# EAGLE design Main board (EAGLE 6.3)
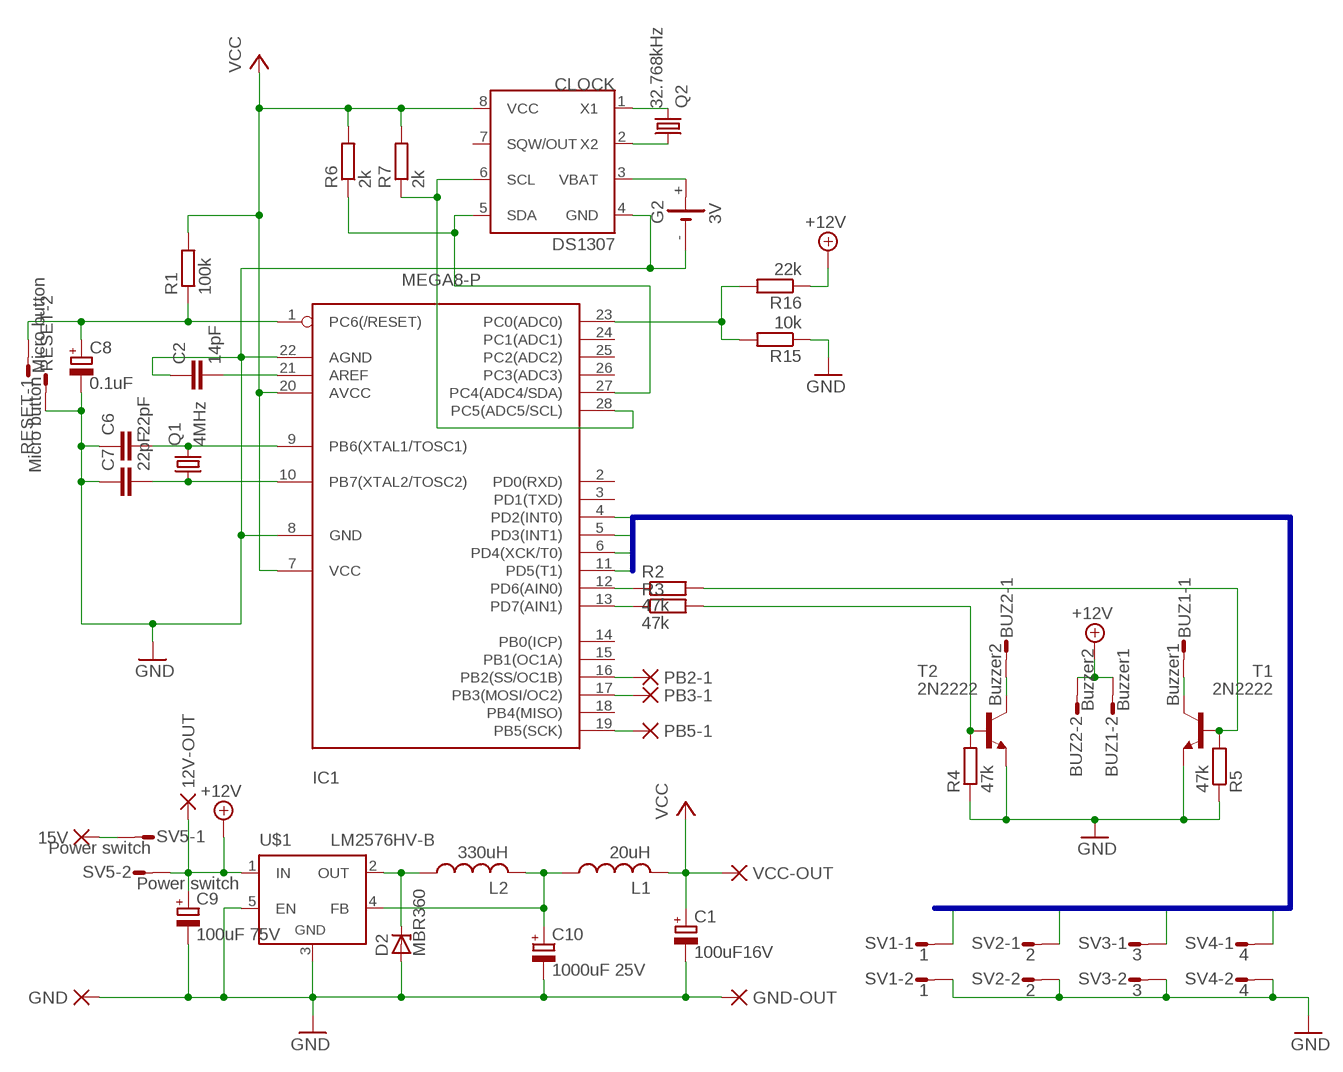
[diagram p0: schematic, sheet 1]

## Parts
12V-OUT  PAD-0500  [0500]
15V  PAD-0500  [0500]
BUZ1  Buzzer1  S02P  [S02P]
BUZ2  Buzzer2  S02P  [S02P]
C1  100uF16V  CPOL-EUE2.5-6  [E2,5-6]
C2  14pF  C-EU025-050X050  [C025-050X050]
C6  22pF  C-EU025-030X050  [C025-030X050]
C7  22pF  C-EU025-030X050  [C025-030X050]
C8  0.1uF  CPOL-EUE2.5-6  [E2,5-6]
C9  100uF 75V  CPOL-EUE5-10.5  [E5-10,5]
C10  1000uF 25V  CPOL-EUE5-10.5  [E5-10,5]
CLOCK  DS1307  [SOIC-8]
D2  MBR360  ZENER-DIODEC1702-15  [C1702-15]
G2  3V  SL-340/P  [BEL/P]
GND  PAD-0500  [0500]
GND-OUT  PAD-0500  [0500]
IC1  MEGA8-P  [DIL28-3]
L1  20uH  L-USTJ3-U1  [TJ3-U1]
L2  330uH  L-USTJ3-U1  [TJ3-U1]
PB2-1  PAD-0400  [0400]
PB3-1  PAD-0400  [0400]
PB5-1  PAD-0400  [0400]
Q1  4MHz  CRYSTALHC49U-V  [HC49U-V]
Q2  32.768kHz  CRYSTAL  [CRYSTAL]
R1  100k  R-EU_0309/15  [0309/15]
R2  47k  R-EU_0309/15  [0309/15]
R3  47k  R-EU_0309/15  [0309/15]
R4  47k  R-EU_0309/15  [0309/15]
R5  47k  R-EU_0309/15  [0309/15]
R6  2k  R-EU_0309/15  [0309/15]
R7  2k  R-EU_0309/15  [0309/15]
R15  10k  R-EU_0309/15  [0309/15]
R16  22k  R-EU_0309/15  [0309/15]
RESET  Micro button  S02P  [S02P]
SV1  1  S02P  [S02P]
SV2  2  S02P  [S02P]
SV3  3  S02P  [S02P]
SV4  4  S02P  [S02P]
SV5  Power switch  S02P  [S02P]
T1  2N2222  [TO18]
T2  2N2222  [TO18]
U$1  LM2576HV-B  [TO220-53]
VCC-OUT  PAD-0500  [0500]

## Nets
+12V: 12V-OUT.P$1(P) BUZ1.2 BUZ2.2 C9.+ R16.1 SV5.2 U$1.1(IN)
GND: C1.- C2.1 C6.1 C7.1 C8.- C9.- C10.- CLOCK.4(GND) D2.A G2.- GND-OUT.P$1(P) GND.P$1(P) IC1.8(GND) IC1.22(AGND) R4.1 R5.1 R15.1 RESET.2 SV1.2 SV2.2 SV3.2 SV4.2 T1.1(E) T2.1(E) U$1.3(GND) U$1.5(EN)
INPUT1: IC1.4(PD2(INT0)) SV1.1
INPUT2: IC1.5(PD3(INT1)) SV2.1
INPUT3: IC1.6(PD4(XCK/T0)) SV3.1
INPUT4: IC1.11(PD5(T1)) SV4.1
N$1: CLOCK.1(X1) Q2.2
N$2: 15V.P$1(P) SV5.1
N$3: CLOCK.2(X2) Q2.1
N$14: C2.2 IC1.21(AREF)
N$15: C6.2 IC1.9(PB6(XTAL1/TOSC1)) Q1.2
N$16: C7.2 IC1.10(PB7(XTAL2/TOSC2)) Q1.1
N$18: C8.+ IC1.1(PC6(/RESET)) R1.1 RESET.1
N$19: CLOCK.6(SCL) IC1.28(PC5(ADC5/SCL)) R7.1
N$20: IC1.23(PC0(ADC0)) R15.2 R16.2
N$22: CLOCK.5(SDA) IC1.27(PC4(ADC4/SDA)) R6.1
N$33: IC1.12(PD6(AIN0)) R2.1
N$34: IC1.13(PD7(AIN1)) R3.1
N$36: BUZ2.1 T2.3(C)
N$37: R3.2 R4.2 T2.2(B)
N$39: R2.2 R5.2 T1.2(B)
N$40: BUZ1.1 T1.3(C)
N$60: IC1.16(PB2(SS/OC1B)) PB2-1.P$1(P)
N$63: C10.+ L1.1 L2.2 U$1.4(FB)
N$64: D2.C L2.1 U$1.2(OUT)
N$66: IC1.17(PB3(MOSI/OC2)) PB3-1.P$1(P)
N$67: IC1.19(PB5(SCK)) PB5-1.P$1(P)
VBAT: CLOCK.3(VBAT) G2.+
VCC: C1.+ CLOCK.8(VCC) IC1.7(VCC) IC1.20(AVCC) L1.2 R1.2 R6.2 R7.2 VCC-OUT.P$1(P)
Unconnected: CLOCK.7(SQW/OUT) IC1.2(PD0(RXD)) IC1.3(PD1(TXD)) IC1.14(PB0(ICP)) IC1.15(PB1(OC1A)) IC1.18(PB4(MISO)) IC1.24(PC1(ADC1)) IC1.25(PC2(ADC2)) IC1.26(PC3(ADC3))

## Buses
INPUT[1..4]

## Library data of the parts
12V-OUT 15V GND GND-OUT PB2-1 PB3-1 PB5-1 VCC-OUT = ~~dpads:PAD: WIRE PAD Standard US Drill Sizes and SMD pads
BUZ1 BUZ2 RESET SV1-SV5 = con-amp-mt:S02P: AMP MT CONNECTOR
C1 C9 C10 = ~~rcl:CPOL-EU: POLARIZED CAPACITOR, European symbol
C2 C6 C7 = ~~rcl:C-EU: CAPACITOR, European symbol
C8 = rcl:CPOL-EU: POLARIZED CAPACITOR, European symbol
CLOCK = ~~dallas:DS1307: I2C Serial RTC w/56 bytes battery backed RAM
D2 = diode:ZENER-DIODE: Z-Diode
G2 = battery:SL-340/P: LI BATTERY Sonnenschein SL-340
IC1 = atmel:MEGA8-P: MICROCONTROLLER 8 Kbytes FLASH, 1 kbytes SRAM, 512 bytes EEPROM, USART, 4-channel 10 bit ADC, 2-channel 8 bit ADC Pin compatible with Atmega48, ATMega88, ATMega168 Source: avr.lbr
L1 L2 = ~~rcl:L-US: INDUCTOR, American symbol
Q1 = crystal:CRYSTAL: CRYSTAL
Q2 = ~~mano:CRYSTAL
R1-R7 R15 R16 = ~~rcl:R-EU_: RESISTOR, European symbol
T1 T2 = transistor:2N2222: NPN TRANSISTOR
U$1 = ~~linear:LM2576HV-*

## Board
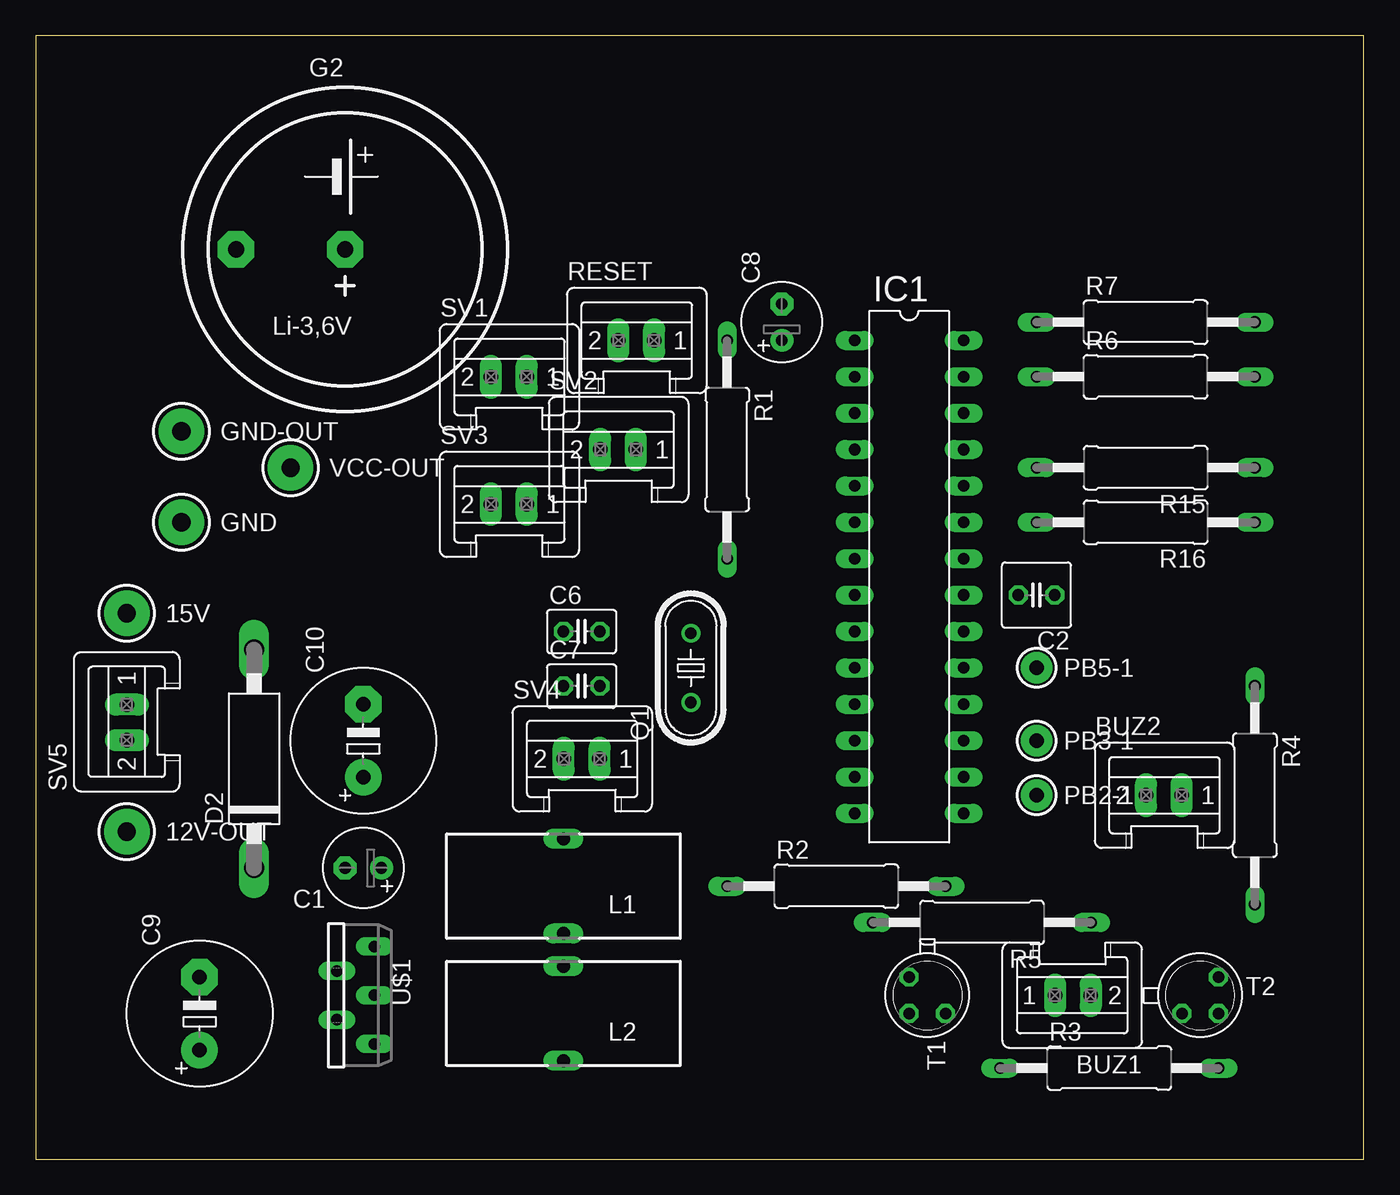
[diagram p1: board, top side]
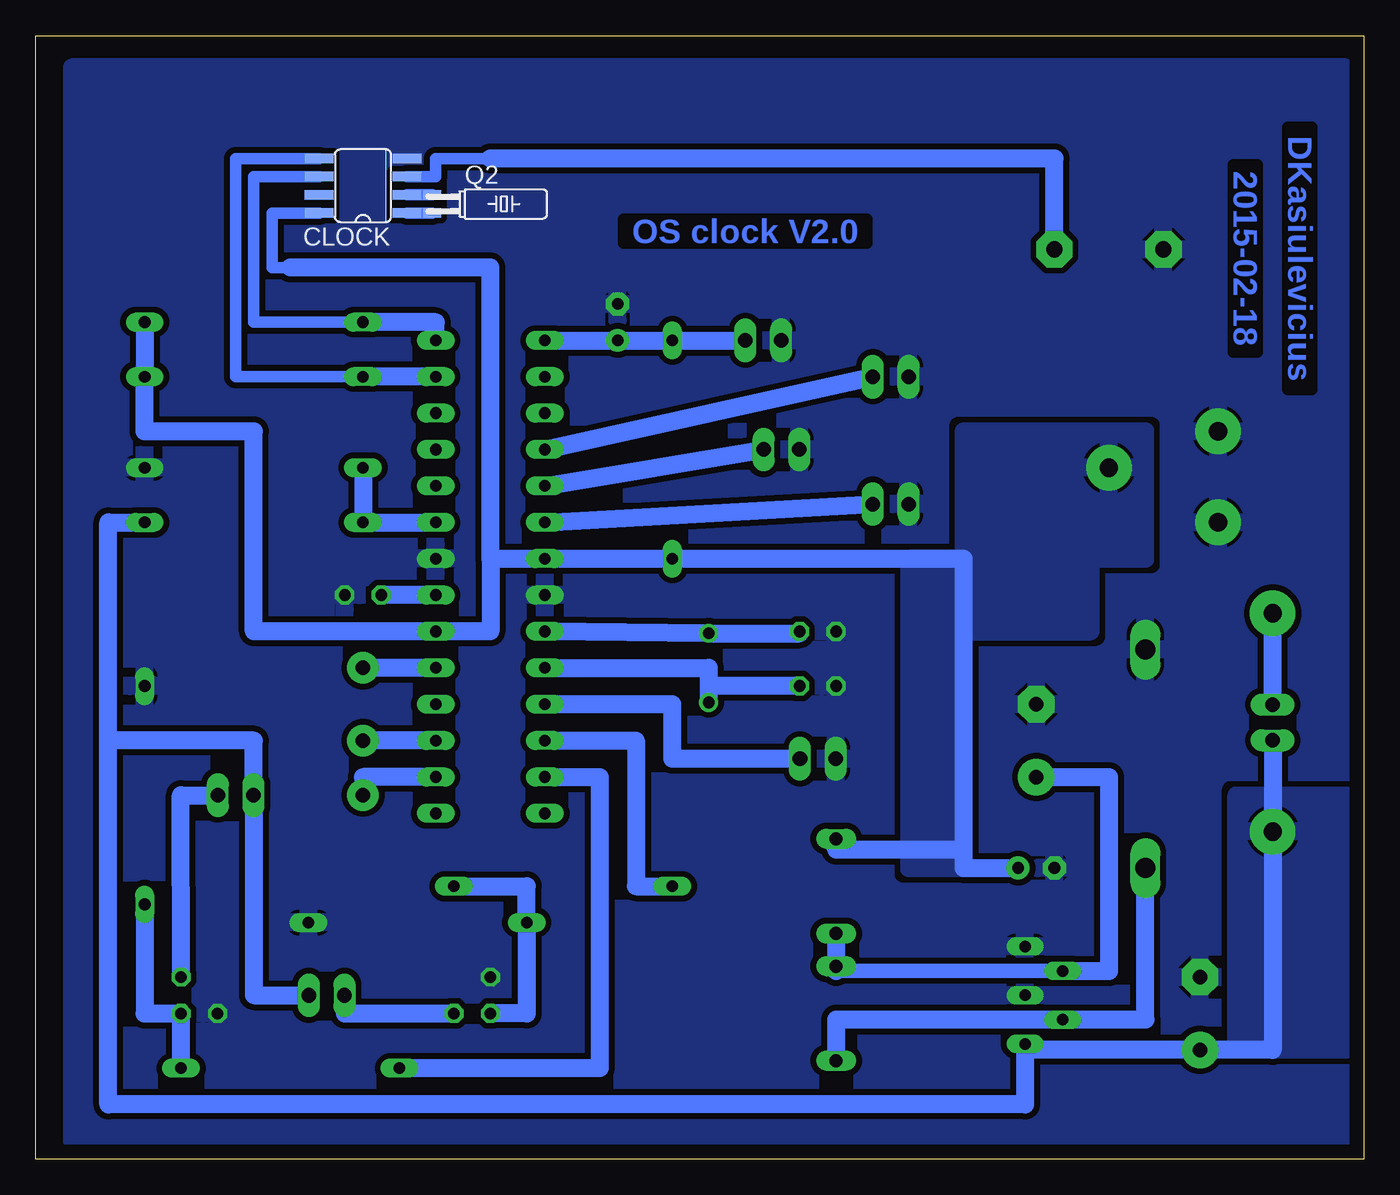
[diagram p2: board, bottom side, seen from below]

Size 92.69 x 78.41 mm. Coordinates in mm from the lower left corner, seen from the top.
Outline: 0,0 92.69,0 92.69,78.41 0,78.41 0,0
Copper layers (1*16): Top 0.035mm / dielectric 1.5mm / Bottom 0.035mm
Design rules "stori": minimum track width 20mil, minimum drill 24mil, track to track 16mil, track to pad 16mil, pad to pad 16mil, via to via 16mil, smd to smd 16mil, copper to edge 40mil, drill to drill 16mil, minimum pad ring 10mil, minimum via ring 8mil, stop-mask expansion 4mil, vias tented up to drill 0mil, thermal gap 10mil

### Footprints (pad centres in the part's own frame; a part is rotated, then mirrored left to right if it is on the bottom)
0500 = drill 1.27 pad 3.175: P$1 0,0
S02P = drill 1.016 long: 1 1.25,0; 2 -1.25,0
E2,5-6 = drill 0.813 pad 1.6: + -1.27,0 | drill 0.813 pad 1.6 octagon: - 1.27,0
C025-050X050 = drill 0.813 octagon: 1 -1.27,0; 2 1.27,0
C025-030X050 = drill 0.813 octagon: 1 -1.27,0; 2 1.27,0
E5-10,5 = drill 1.016 pad 2.54: + -2.54,0 | drill 1.016 pad 2.54 octagon: - 2.54,0
SOIC-8 = smd 2.032 x 0.66: 1 -3.073,1.27; 2 -3.073,0; 3 -3.073,-1.27; 4 -3.073,-2.54; 5 3.073,-2.54; 6 3.073,-1.27; 7 3.073,0; 8 3.073,1.27
C1702-15 = drill 1.397 long: A 7.62,0; C -7.62,0
BEL/P = drill 1.118 pad 2.54 octagon: + 0,0; - -7.62,0
DIL28-3 = drill 0.813 long: 1 -16.51,-3.81; 2 -13.97,-3.81; 3 -11.43,-3.81; 4 -8.89,-3.81; 5 -6.35,-3.81; 6 -3.81,-3.81; 7 -1.27,-3.81; 8 1.27,-3.81; 9 3.81,-3.81; 10 6.35,-3.81; 11 8.89,-3.81; 12 11.43,-3.81; 13 13.97,-3.81; 14 16.51,-3.81; 15 16.51,3.81; 16 13.97,3.81; 17 11.43,3.81; 18 8.89,3.81; 19 6.35,3.81; 20 3.81,3.81; 21 1.27,3.81; 22 -1.27,3.81; 23 -3.81,3.81; 24 -6.35,3.81; 25 -8.89,3.81; 26 -11.43,3.81; 27 -13.97,3.81; 28 -16.51,3.81
TJ3-U1 = drill 0.9 long: 1 -3.3,0; 2 3.3,0
0400 = drill 1.016 pad 2.184: P$1 0,0
HC49U-V = drill 0.813: 1 -2.413,0; 2 2.413,0
CRYSTAL = smd 0.66 x 1.27: 1 -0.635,-0.254; 2 0.635,-0.254
0309/15 = drill 0.813 long: 1 -7.62,0; 2 7.62,0
TO18 = drill 0.813 octagon: 1 -1.27,-1.27; 2 1.27,-1.27; 3 1.27,1.27
TO220-53 = drill 0.8 long: 1 -3.4,-2.05; 2 -1.7,0.58; 3 0,-2.05; 4 1.7,0.58; 5 3.4,-2.05

### Placement (x,y rotation side)
12V-OUT  6.35,22.86 0 top
15V  6.35,38.1 0 top
BUZ1  72.39,11.43 180 top
BUZ2  78.74,25.4 0 top
C1  22.86,20.32 180 top
C2  69.85,39.37 180 top
C6  38.1,36.83 0 top
C7  38.1,33.02 0 top
C8  52.07,58.42 90 top
C9  11.43,10.16 90 top
C10  22.86,29.21 90 top
CLOCK  69.85,67.31 180 bottom
D2  15.24,27.94 90 top
G2  21.59,63.5 0 top
GND  10.16,44.45 0 top
GND-OUT  10.16,50.8 0 top
IC1  60.96,40.64 270 top
L1  36.83,19.05 90 top
L2  36.83,10.16 90 top
PB2-1  69.85,25.4 0 top
PB3-1  69.85,29.21 0 top
PB5-1  69.85,34.29 0 top
Q1  45.72,34.29 90 top
Q2  64.77,66.67 270 bottom
R1  48.26,49.53 270 top
R2  55.88,19.05 0 top
R3  74.93,6.35 0 top
R4  85.09,25.4 270 top
R5  66.04,16.51 180 top
R6  77.47,54.61 0 top
R7  77.47,58.42 0 top
R15  77.47,48.26 180 top
R16  77.47,44.45 180 top
RESET  41.91,57.15 0 top
SV1  33.02,54.61 0 top
SV2  40.64,49.53 0 top
SV3  33.02,45.72 0 top
SV4  38.1,27.94 0 top
SV5  6.35,30.48 90 top
T1  62.23,11.43 270 top
T2  81.28,11.43 0 top
U$1  21.59,11.43 90 top
VCC-OUT  17.78,48.26 0 top

### Tracks (layer width: path | path; a pad name or v marks a point on that pad's centre or on a via)
+12V
  Bottom 1.27: SV5.2 12V-OUT.P$1 6.35,7.62 C9.+ 23.64,7.62 U$1.1 23.64,3.81 87.63,3.81 87.63,29.21 | 87.63,29.21 87.63,44.45 R16.1 | BUZ1.2 77.47,11.43 BUZ2.2 77.47,29.21 87.63,29.21
  pour Bottom: 8.89,7.62 8.89,25.4 1.27,25.4 1.27,7.62
GND
  pour Bottom (rank 6): 1.27,1.27 1.27,76.2 90.17,76.2 90.17,1.27
INPUT1
  Bottom 1.27: IC1.4 SV1.1
INPUT2
  Bottom 1.27: IC1.5 SV2.1
INPUT3
  Bottom 1.27: IC1.6 SV3.1
INPUT4
  Bottom 1.27: SV4.1 48.26,27.94 48.26,31.75 IC1.11
N$1
  Bottom 0.813: CLOCK.1 Q2.2
N$2
  Bottom 1.27: SV5.1 15V.P$1
N$3
  Bottom 0.813: CLOCK.2 Q2.1
N$14
  Bottom 1.27: IC1.21 C2.2
N$15
  Bottom 1.27: IC1.9 Q1.2 39.37,36.7 C6.2
N$16
  Bottom 1.27: C7.2 45.72,33.02 | 45.72,33.02 Q1.1 | IC1.10 45.72,34.29 45.72,33.02
N$18
  Bottom 1.27: RESET.1 R1.1 C8.+ IC1.1
N$19
  Bottom 0.813: CLOCK.6 77.47,68.58 77.47,58.42 R7.1
  Bottom 1.27: IC1.28 64.77,58.42 R7.1
N$20
  Bottom 1.27: R15.2 R16.2 IC1.23
N$22
  Bottom 0.813: CLOCK.5 78.74,69.85 78.74,54.61 R6.1
  Bottom 1.27: IC1.27 R6.1
N$33
  Bottom 1.27: IC1.12 50.8,29.21 50.8,19.05 R2.1
N$34
  Bottom 1.27: IC1.13 53.34,26.67 53.34,6.35 R3.1
N$36
  Bottom 1.27: T2.3 82.57,25.4 BUZ2.1
N$37
  Bottom 1.27: R3.2 T2.2 85.09,10.16 R4.2
N$39
  Bottom 1.27: R2.2 58.42,19.05 R5.2 58.42,10.16 T1.2
N$40  (1 unrouted)
  Bottom 1.27: 71.12,11.43 71.12,10.16 T1.3
N$60
  Bottom 1.27: IC1.16 69.85,26.67 PB2-1.P$1
N$63
  Bottom 1.016: U$1.4 36.83,13.13
  Bottom 1.27: C10.+ 17.78,26.67 17.78,13.13 U$1.4 | L1.1 L2.2 36.83,13.13
N$64
  Bottom 1.27: L2.1 36.83,9.73 U$1.2 15.24,9.73 D2.C
N$66
  Bottom 1.27: IC1.17 PB3-1.P$1
N$67
  Bottom 1.27: IC1.19 PB5-1.P$1
VBAT
  Bottom 0.813: CLOCK.3 64.77,68.58 64.77,69.85 60.96,69.85
  Bottom 1.27: G2.+ 21.59,69.85 60.96,69.85
VCC
  Bottom 0.813: CLOCK.8 76.2,66.04 76.2,62.23 74.93,62.23
  Bottom 1.27: 27.94,21.59 36.83,21.59 L1.2 | R7.2 R6.2 85.09,50.8 77.47,50.8 77.47,36.83 IC1.20 60.96,36.83 60.96,41.91 | 27.94,21.59 27.94,41.91 R1.2 IC1.7 60.96,41.91 | 60.96,41.91 60.96,62.23 74.93,62.23 | 27.94,21.59 27.94,20.32 C1.+
  pour Bottom: 15.24,41.91 15.24,50.8 27.94,50.8 27.94,41.91 31.75,41.91 31.75,20.32 27.94,20.32 27.94,36.83 19.05,36.83 19.05,41.91

### Text on the board
Bottom: OS clock V2.0 | DKasiulevicius | 2015-02-18